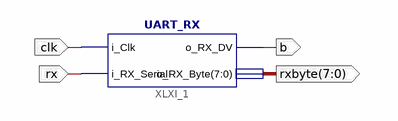
[diagram p0: schematic sheet 1]
// Xilinx ISE schematic rx.sch (spartan6) as structural Verilog: 1 symbols, 4 ports
module rx (
  input  clk,
  input  rx,
  output b,
  output [7:0] rxbyte
);

  UART_RX XLXI_1 (.i_Clk(clk), .i_RX_Serial(rx), .o_RX_DV(b), .o_RX_Byte(rxbyte));
endmodule
